# EAGLE design SPI FRAM Rev C (EAGLE 9.6.2)
COMPANY: Adafruit Industries; DRAWN: KTOWN; REV: A; YEAR: 2018
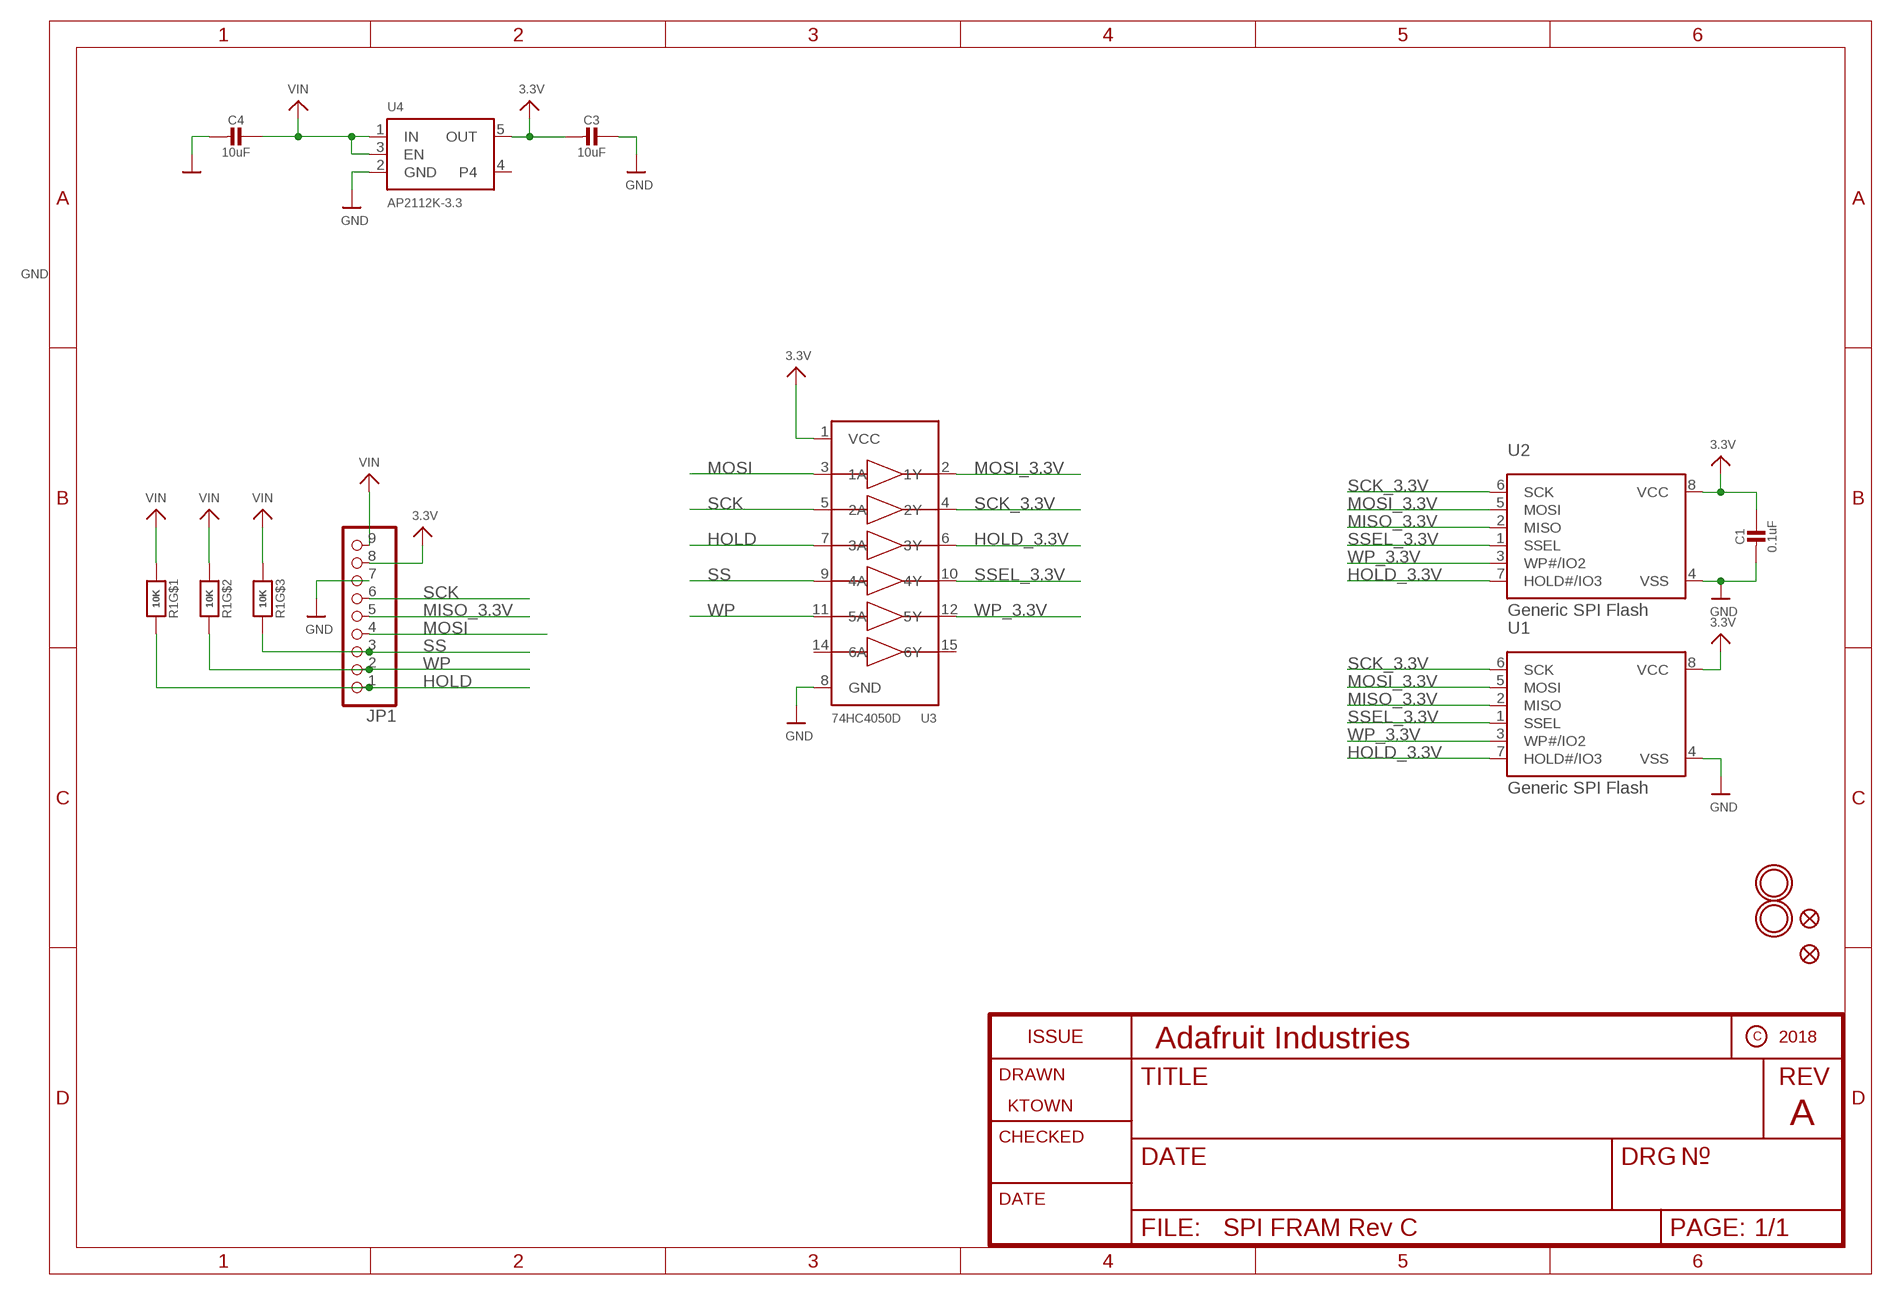
[diagram p0: schematic, sheet 1]

## Parts
C1  0.1uF  CAP_CERAMIC0603_NO  [0603-NO]
C3  10uF  CAP_CERAMIC0805-NOOUTLINE  [0805-NO]
C4  10uF  CAP_CERAMIC0805-NOOUTLINE  [0805-NO]
FID2  FIDUCIAL_1MM  [FIDUCIAL_1MM]
FID3  FIDUCIAL_1MM  [FIDUCIAL_1MM]
JP1  HEADER-1X970MIL  [1X09_ROUND_70]
R1  10K  RESISTOR_4PACK  [RESPACK_4X0603]
U1  Generic SPI Flash  SPIFLASH_8PIN208MIL  [SOIC8_208MIL]
U2  Generic SPI Flash  SPIFLASH_8PINUX  [USON8]
U3  74HC4050D  74HC4050DTSSOP  [TSSOP16]
U4  AP2112K-3.3  VREG_SOT23-5  [SOT23-5]
U$16  MOUNTINGHOLE2.5  [MOUNTINGHOLE_2.5_PLATED]
U$17  MOUNTINGHOLE2.5  [MOUNTINGHOLE_2.5_PLATED]

## Nets
3.3V: C1.1 C3.2 JP1.8 U1.8(VCC) U2.8(VCC) U3.1(VCC) U4.5(OUT)
GND: C1.2 C3.1 C4.2 JP1.7 U1.4(VSS) U2.4(VSS) U3.8(GND) U4.2(GND)
HOLD: JP1.1 R1.8 U3.7(3A)
HOLD_3.3V: U1.7(HOLD#/IO3) U2.7(HOLD#/IO3) U3.6(3Y)
MISO_3.3V: JP1.5 U1.2(MISO) U2.2(MISO)
MOSI: JP1.4 U3.3(1A)
MOSI_3.3V: U1.5(MOSI) U2.5(MOSI) U3.2(1Y)
SCK: JP1.6 U3.5(2A)
SCK_3.3V: U1.6(SCK) U2.6(SCK) U3.4(2Y)
SS: JP1.3 R1.6 U3.9(4A)
SSEL_3.3V: U1.1(SSEL) U2.1(SSEL) U3.10(4Y)
VIN: C4.1 JP1.9 R1.1 R1.2 R1.3 U4.1(IN) U4.3(EN)
WP: JP1.2 R1.7 U3.11(5A)
WP_3.3V: U1.3(WP#/IO2) U2.3(WP#/IO2) U3.12(5Y)
Unconnected: R1.4 R1.5 U3.14(6A) U3.15(6Y) U4.4

## Library data of the parts
C1 C3 C4 = microbuilder:CAP_CERAMIC: Ceramic Capacitors For new designs, use the packages preceded by an '_' character since they are more reliable: The following footprints should be used on most boards: _0402 - Standard footprint for regular board layouts _0603 - Standard footprint for regular board layouts _0805 - Standard footprint for regular board layouts _1206 - Standard footprint for regular board layouts For extremely tight-pitch boards where space is at a premium, the following 'micro-pitch' footprints can be used (smaller pads, no silkscreen outline, etc.): _0402MP - Micro-pitch footprint for very dense/compact boards _0603MP - Micro-pitch footprint for very dense/compact boards _0805MP - Micro-pitch footprint for very dense/compact boards _1206MP - Micro-pitch footprint for very dense/compact boards
FID2 FID3 = microbuilder:FIDUCIAL: Fiducial Alignment Points Various fiducial points for machine vision alignment.; BOM: EXCLUDE
JP1 = microbuilder:HEADER-1X9: PIN HEADER
R1 = microbuilder:RESISTOR_4PACK: Resistor Packs (4 resistors) 4 x 0603 10K 1/16W - Digikey: YC164J-10KCT-ND
U1 U2 = microbuilder:SPIFLASH_8PIN: SOIC8 SPI Flash Be careful with the size since SOIC8 flash comes in several 'widths' SOIC8 150 mil M25P16 - 16Mbit (2Mbit x 8) Serial Flash (75MHz SPI Bus), Supply: 2.7-3.6V Digikey: SOIC8 - M25P16-VMN6P-ND SOIC8 208 mil W25Q16BVSSIG - 16Mbit (2Mbit x 8) Serial Flash (104MHz SPI Bus), Supply: 2.7-3.6V Digikey: SOIC8 - W25Q16BVSSIG-ND
U3 = microbuilder:74HC4050D: 6-channel level shifter 74HC4050D - 2V-6V Supply SOIC16 Digikey: 74HC4050D,653-ND Mouser: 771-74HC4050D-T TSSOP16 Digikey: 296-9215-1-ND Mouser:
U4 = microbuilder:VREG_SOT23-5: SOT23-5 Fixed Voltage Regulators Part Current Out V Out V In V Dropout θJA (°C/W) TJ (°C) Digikey Part No. ADP121 150mA 3.3V 3.4-5.5V 0.09V @ 150mA -- -- ADP121-AUJZ33R7CT-ND ADP121 150mA 3.0V 3.1-5.5V 0.09V @ 150mA -- -- ADP121-AUJZ30R7CT-ND ADP122 300mA 3.3V 3.4-5.5V 0.085V @ 300mA -- -- ADP122AUJZ-3.3-R7CT-ND ADP1712 300mA 3.3V 3.5-5.5V 0.17V @ 300mA -- -- ADP1712AUJZ-3.3-R7TR-ND AP7311 (Low Cost) 150mA 3.3V 3.5-6V 0.15V @ 150mA -- -- AP7311-33WG-7DICT-ND LD39015M18R 150mA 1.8V 1.9V-5.5V 0.08V @ 100mA -- -- 497-6977-1-ND LP2985A-33DBVR 150mA 3.3V 3.3-16V 0.28V @ 150mA 206 150 296-18479-1-ND MCP1824T-3302E/OT 300mA 3.3V 3.5V-6V 0.2V @ 300mA -- -- MCP1824T-3302E/OTCT-ND MIC5205-2.5YM5 TR 150mA 2.5V 2.7-16V 0.165V @ 150mA -- -- 576-1257-2-ND MIC5205-3.0YM5 TR 150mA 3.0V 3.2V-16V 0.165V @ 150mA -- -- 576-1258-2-ND MIC5205-3.3YM5 TR 150mA 3.3V 3.5V-16V 0.165V @ 150mA -- -- 576-1259-2-ND TPS780330220 150mA 3.3V+2.2V 3.6-5.5V 250mV Max -- -- 296-23332-1-ND TDA3663/N1,135 100mA 3.3V 3.5-45V 0.18V @ 50mA -- -- 568-5343-1-ND Max operating temp can be calculated using θJA, TJ (max junction temperature), and power in watts. Set the "Maximum Ambient Temperature" until it reaches TJ ("Max Junction Temperature"), which is the absolute limit for safe use of the regulator: Heat Sink Temperature Calculator <http://www.daycounter.com/Calculators/Heat-Sink-Temperature-Calculator.phtml> For example, With 12V source into a 3.3V LP2985 and a 30mA load, we are dissipating (12V-3.3V) * 0.03A = 0.261W. With a θJA of 206 °C/W, a TJ of 150°C, and 261mW we can safely use the chip without a heat sink up to 75°C (=147.1°C Junction Temperature).
U$16 U$17 = microbuilder:MOUNTINGHOLE: Mounting Hole For #2 screws (0.086"/2.18mm width, 0.094"/2.4mm hole) use 2.5mm; BOM: EXCLUDE

## Board
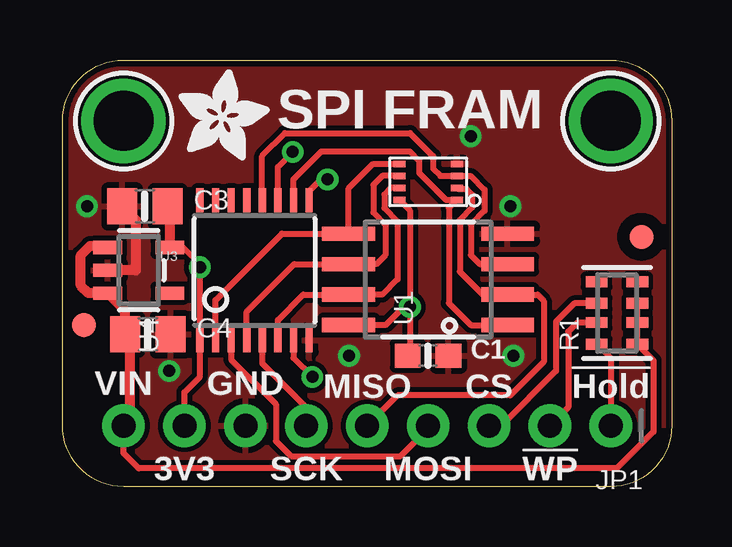
[diagram p1: board, top side]
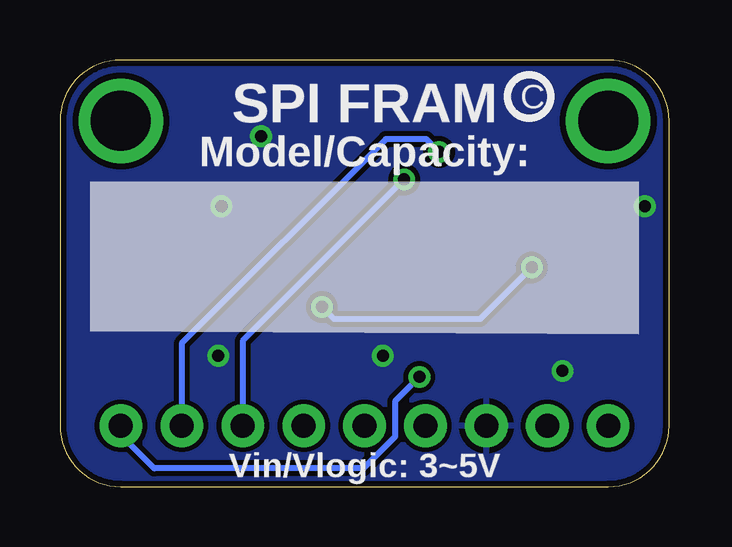
[diagram p2: board, bottom side, seen from below]

Size 25.4 x 17.78 mm. Coordinates in mm from the lower left corner, seen from the top.
Outline: 0,2.54 0,15.24 arc-90 2.54,17.78 22.86,17.78 arc-90 25.4,15.24 25.4,2.54 arc-90 22.86,0 2.54,0 arc-90 0,2.54
Copper layers (1*16): Top 0.035mm / dielectric 1.5mm / Bottom 0.035mm
Design rules "adafruit": minimum track width 8mil, minimum drill 15.5mil, track to track 8mil, track to pad 8mil, pad to pad 8mil, via to via 8mil, smd to smd 8mil, copper to edge 10mil, drill to drill 8mil, minimum pad ring 10mil, minimum via ring 8mil, stop-mask expansion 2mil, vias tented up to drill 20mil, thermal gap 10mil

### Footprints (pad centres in the part's own frame; a part is rotated, then mirrored left to right if it is on the bottom)
0603-NO = smd 1.075 x 1: 1 -0.85,0; 2 0.85,0
0805-NO = smd 1.24 x 1.5: 1 -0.95,0; 2 0.95,0
FIDUCIAL_1MM = smd 1 x 1: 1 0,0
1X09_ROUND_70 = drill 1 pad 1.778: 1 -10.16,0; 2 -7.62,0; 3 -5.08,0; 4 -2.54,0; 5 0,0; 6 2.54,0; 7 5.08,0; 8 7.62,0; 9 10.16,0
RESPACK_4X0603 = smd 0.45 x 0.9: 1 -1.3,-0.85; 2 -0.4,-0.85; 3 0.4,-0.85; 4 1.3,-0.85; 5 1.3,0.85; 6 0.4,0.85; 7 -0.4,0.85; 8 -1.3,0.85
SOIC8_208MIL = smd 0.6 x 2.2: 1 -1.905,-3.315; 2 -0.635,-3.315; 3 0.635,-3.315; 4 1.905,-3.315; 5 1.905,3.315; 6 0.635,3.315; 7 -0.635,3.315; 8 -1.905,3.315
USON8 = smd 0.5 x 0.275: 1 -1.2,0.75; 2 -1.2,0.25; 3 -1.2,-0.25; 4 -1.2,-0.75; 5 1.2,-0.75; 6 1.2,-0.25; 7 1.2,0.25; 8 1.2,0.75
TSSOP16 = smd 0.305 x 0.991: 1 -2.275,-2.918; 2 -1.625,-2.918; 3 -0.975,-2.918; 4 -0.325,-2.918; 5 0.325,-2.918; 6 0.975,-2.918; 7 1.625,-2.918; 8 2.275,-2.918; 9 2.275,2.918; 10 1.625,2.918; 11 0.975,2.918; 12 0.325,2.918; 13 -0.325,2.918; 14 -0.975,2.918; 15 -1.625,2.918; 16 -2.275,2.918
SOT23-5 = smd 0.55 x 1.2: 1 -0.95,-1.3; 2 0,-1.3; 3 0.95,-1.3; 4 0.95,1.3; 5 -0.95,1.3
MOUNTINGHOLE_2.5_PLATED = drill 2.5 pad 3.2: P$1 0,0

### Placement (x,y rotation side)
C1  15.24,5.46 0 top
C3  3.43,11.68 0 top
C4  3.56,6.35 0 top
FID2  0.89,6.73 0 top
FID3  24.13,10.41 0 top
JP1  12.7,2.54 180 top
R1  23.11,7.24 90 top
U1  15.24,8.64 90 top
U2  15.24,12.7 180 top
U3  8,9.02 0 top
U4  3.17,9.02 270 top
U$16  2.54,15.24 0 top
U$17  22.86,15.24 0 top
U$19  [ADAFRUIT_3.5MM]  4.83,13.59 0 top
U$21  [PCBFEAT-REV-040]  5.84,16.26 0 bottom

### Tracks (layer width: path | path; a pad name or v marks a point on that pad's centre or on a via)
3.3V  (via drill 0.5)
  Top 0.254: U2.8 14.48,11.51 14.48,7.75 | U1.8 13.46,6.73 14.48,7.75 | 14.48,7.75 v14.48,7.49 14.48,5.55 C1.1 | JP1.8 5.08,3.94 5.73,4.58 U3.1 v5.73,9.14 5.73,9.26 5.02,9.97 U4.5
  Top 0.406: U4.5 4.47,11.59 C3.2
  Bottom 0.254: v5.73,9.14 7.88,6.99 13.97,6.99 v14.48,7.49
GND  (via drill 0.5)
  Top 0.406: C3.1 3.05,11.12 3.05,9.02 U4.2
  other vias: 11.94,5.46 4.45,4.83 1.02,11.68 18.67,11.68 17.02,14.61 18.8,5.46
  pour Top: 0,17.78 25.4,17.78 25.4,0 0,0
  pour Bottom: 0,17.78 25.4,17.78 25.4,0 0,0
HOLD  (via drill 0.5)
  Top 0.254: R1.8 22.86,5.34 JP1.1 | U3.7 9.63,5.36 v10.41,4.57
  Bottom 0.254: v10.41,4.57 11.43,3.56 11.43,2.09 12.75,0.76 21.46,0.76 22.86,2.16 JP1.1
HOLD_3.3V
  Top 0.254: U3.6 8.98,6.94 10.03,8 U1.7 13.34,8 13.97,8.64 13.97,11.06 13.41,11.62 13.41,12.18 13.69,12.45 U2.7
MISO_3.3V
  Top 0.254: U2.2 16.47,12.42 16.83,12.42 17.08,12.17 17.08,11.63 16.56,11.11 16.56,8.97 17.53,8 U1.2 19.81,8 20.07,7.75 20.07,5.21 18.67,3.81 13.97,3.81 JP1.5
MOSI
  Top 0.254: U3.3 7.03,5.29 8.89,3.43 8.89,1.91 9.53,1.27 14.1,1.27 15.24,2.41 JP1.4
MOSI_3.3V
  Top 0.254: U3.2 6.38,7.77 9.14,10.54 U1.5 11.93,12.43 12.94,13.45 U2.5
SCK
  Top 0.254: U3.5 8.33,5.14 10.16,3.3 JP1.6
SCK_3.3V
  Top 0.254: U3.4 7.68,7.29 9.65,9.27 U1.6 13.08,9.27 13.46,9.65 13.46,10.92 12.95,11.43 12.95,12.57 13.33,12.95 U2.6
SS  (via drill 0.5)
  Top 0.254: U3.9 10.28,12.32 10.77,12.81 v11.05,12.81 | R1.6 21.34,7.64 20.57,6.88 20.57,4.83 18.29,2.54 JP1.3
  Bottom 0.254: v11.05,12.81 17.78,6.08 JP1.3
SSEL_3.3V
  Top 0.254: U1.1 17.02,6.73 16.1,7.64 16.1,11.61 U2.1 15.99,11.95 14.86,13.08 14.86,13.59 14.48,13.97 10.79,13.97 9.63,12.8 U3.10
VIN
  Top 0.254: R1.3 R1.2 R1.1 24.64,5.26 24.64,2.29 23.11,0.76 3.17,0.76 2.54,1.4 JP1.9
  Top 0.406: JP1.9 2.79,2.79 2.79,6.16 C4.1 2.61,7.34 U4.3 1.08,8.07 0.76,8.38 0.76,9.65 1.14,10.03 1.81,10.03 U4.1
WP  (via drill 0.5)
  Top 0.254: U3.11 8.98,13.33 v9.6,13.95 | R1.7 21.46,6.84 21.08,6.46 21.08,3.3 JP1.2
  Bottom 0.254: v9.6,13.95 10.12,14.48 11.81,14.48 20.32,5.97 JP1.2
WP_3.3V
  Top 0.254: U1.3 17.4,9.27 17.02,9.65 17.02,10.92 17.59,11.49 17.59,12.38 17.02,12.95 U2.3 15.75,12.95 15.44,13.26 15.44,13.78 14.49,14.73 9.27,14.73 8.33,13.79 U3.12

### Text on the board
tPlace: SPI FRAM | VIN | GND | MISO | CS | !Hold | 3V3 | SCK | MOSI | !WP
bPlace: SPI FRAM | Model/Capacity: | Vin/Vlogic: 3~5V